# Altium schematic sheet sb-sonata-fpga.SchDoc: FPGA Config & Misc
size Letter; Organization: NewAE Technology Inc.; Address1: 1083 Queen St., Suite 196; Address2: Halifax; Address3: NS; Address4: Canada B3H 0B2; SheetNumber: 11; SheetTotal: 20; SheetApproved: YES
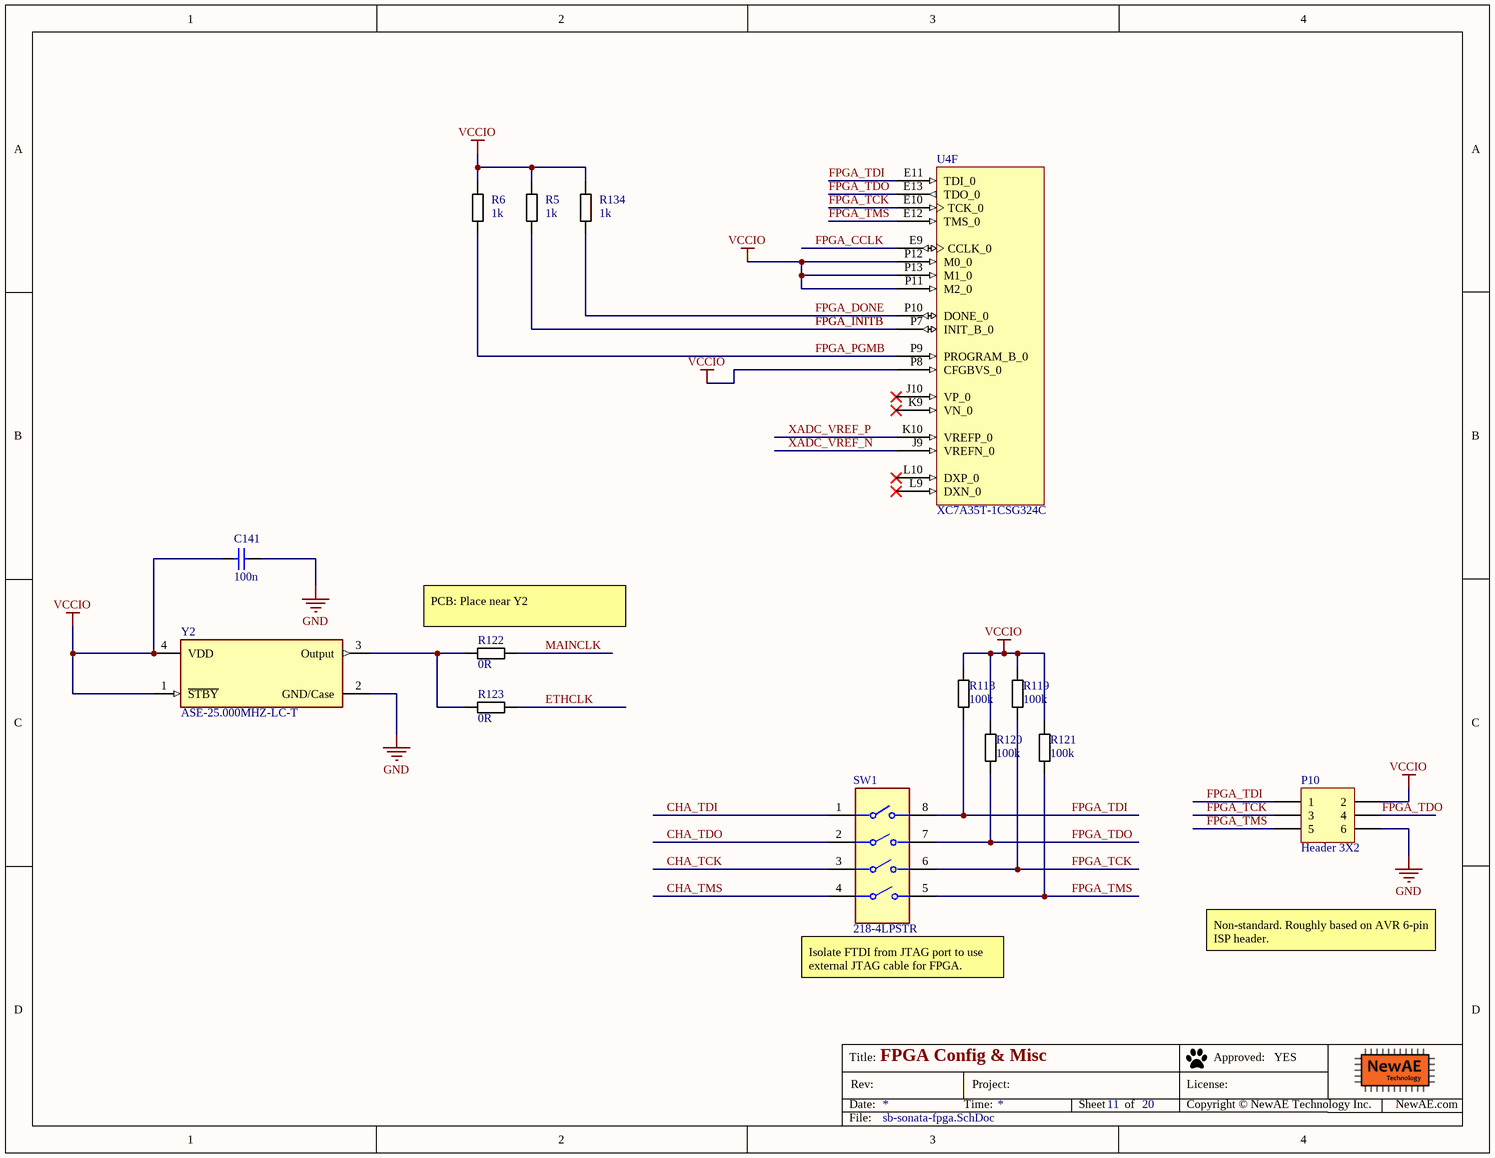
[diagram p0: sb-sonata-fpga.SchDoc]

## Parts
C141  100n  [CAPC0402_M]
P10  Header 3X2  [HDR2X3]
R5  1k  [RESC1608X55N]
R6  1k  [RESC1608X55N]
R118  100k  [RESC1005X40N]
R119  100k  [RESC1005X40N]
R120  100k  [RESC1005X40N]
R121  100k  [RESC1005X40N]
R122  0R  [RESC1608X55N]
R123  0R  [RESC1608X55N]
R134  1k  [RESC1608X55N]
SW1  218-4LPSTR  [FP-218-4LPSTR-MFG]
U4  XC7A35T-1CSG324C  [CSG324]  (part F of 9)
Y2  ASE-25.000MHZ-LC-T  [FP-ASE-MFG]

## Nets
GND: C141.2 P10.6 Y2.2(GND/Case)
VCCIO: C141.1 P10.2 R5.1 R6.1 R118.1 R119.1 R120.1 R121.1 R134.1 U4.P8(CFGBVS_0) U4.P11(M2_0) U4.P12(M0_0) U4.P13(M1_0) Y2.1(~{STBY}) Y2.4(VDD)
CHA_TCK: SW1.3
CHA_TDI: SW1.1
CHA_TDO: SW1.2
CHA_TMS: SW1.4
ETHCLK: R123.2
FPGA_CCLK: U4.E9(CCLK_0)
FPGA_DONE: R134.2 U4.P10(DONE_0)
FPGA_INITB: R5.2 U4.P7(INIT_B_0)
FPGA_PGMB: R6.2 U4.P9(PROGRAM_B_0)
FPGA_TCK: P10.3 R119.2 SW1.6 U4.E10(TCK_0)
FPGA_TDI: P10.1 R118.2 SW1.8 U4.E11(TDI_0)
FPGA_TDO: P10.4 R120.2 SW1.7 U4.E13(TDO_0)
FPGA_TMS: P10.5 R121.2 SW1.5 U4.E12(TMS_0)
MAINCLK: R122.2
XADC_VREF_N: U4.J9(VREFN_0)
XADC_VREF_P: U4.K10(VREFP_0)
NetR122_1: R122.1 R123.1 Y2.3(Output)

Not connected (* = marked no-connect by the designer): U4 J10(VP_0)* K9(VN_0)* L9(DXN_0)* L10(DXP_0)*

## Notes on the sheet
- (near R122) PCB: Place near Y2
- (near SW1) Isolate FTDI from JTAG port to use external JTAG cable for FPGA.
- Non-standard. Roughly based on AVR 6-pin ISP header.
- Title:
- Date:
- Rev:
- Time:
- Project:
- Sheet
- of
- License:
- Copyright © NewAE Technology Inc.
- Approved:
- NewAE.com
- File:

## Library data of the parts
C141 = CCHIP-100n-0402: 100n, 0402; Manufacture Part Number 1: CGA2B3X7R1V104K050BB; Component Group: Capacitor; Case-EIA: 0402; Part Number: CCHIP-100n-0402; Footprint: 0402; Pin Count: 2; Supplier 1: Digi-Key; Supplier Part Number 1: 445-6901-1-ND; Value: 100n; Mounting Technology: SMT; Component Kind: Standard; Component Type: Standard
P10 = Header 3X2: Header, 3-Pin, Dual row; LatestRevisionDate: 17-Jul-2002; LatestRevisionNote: Re-released for DXP Platform.; Publisher: Altium Limited
R5 R6 R134 = RCHIP-1K-0603: 1k res, 0603, 1%, 1/10W; Manufacture 1: Yageo; Manufacture Part Number 1: RC0603FR-071KL; Component Group: Resistor; Case-EIA: 0603; Case-Metric: 1608; Rated Power: 0.1W; Rated Voltage: 75VDC; Part Number: RCHIP-1K-0603; Footprint: 0603; Pin Count: 2; Supplier 1: Digi-Key; Supplier Part Number 1: 311-1.00KHRCT-ND; Value: 1k; Tolerance: 1%; Mounting Technology: SMT; Temperature Range: -55C to 155C; Component Kind: Standard; Component Type: Standard
R118-R121 = RCHIP-100K-0402: 100k res, 0402, 1%, 1/16W; Manufacture 1: Yageo; Manufacture Part Number 1: RC0402FR-07100KL; Component Group: Resistor; Case-EIA: 0402; Case-Metric: 1005; Rated Power: 0.063W; Rated Voltage: 75VDC; Part Number: RCHIP-100K-0402; Footprint: 0402; Pin Count: 2; Supplier 1: Digi-Key; Supplier Part Number 1: 311-100KLRCT-ND; Value: 100k; Tolerance: 1%; Mounting Technology: SMT; Temperature Range: -55C to 155C; Component Kind: Standard; Component Type: Standard
R122 R123 = RCHIP-0R-0603: 0R, 0603, 1/10W; Manufacture 1: Yageo; Manufacture Part Number 1: RC0603FR-070RL; Component Group: Resistor; Case-EIA: 0603; Case-Metric: 1608; Rated Power: 0.1W; Rated Voltage: 75VDC; Tolerance: 1%; Part Number: RCHIP-0R-0603; Footprint: 0603; Pin Count: 2; Supplier 1: Digi-Key; Supplier Part Number 1: 311-0.0HRCT-ND; Value: 0R; Mounting Technology: SMT; Temperature Range: -55C to 155C; Component Kind: Standard; Component Type: Standard
SW1 = CMP-07018-000008-1: SWITCH SLIDE DIP SPST 25MA 24V; Number of Positions: 4; Washable: Yes; Pitch: 0.05inch; Actuator Type: Slide (Standard); Electrical Life: 1000Cycles; Current Rating: 25mA; Contact Material: Copper; Max Current Rating: 25mA; Termination: Gull Wing; Throw Configuration: SPST; Mount: Surface Mount; Radiation Hardening: No; Contact Plating: Gold; Length: 0.246inch; Depth: 8.44mm; Package Quantity: 2000; Packaging: Tape and Reel; Series: 218; Lead Free: Lead Free; Voltage Rating (DC): 24V; Min Operating Temperature: -55°C; RoHS Compliant: Yes; Mechanical Life: 1000Cycles; Max Operating Temperature: 85°C; Orientation: Straight; Max Voltage Rating (DC): 24V
U4 = CMP-0383-00012-1: Artix-7 FPGA, 210 User I/Os, 0 GTP, 324-Ball BGA, Speed Grade 1, Commercial Grade, Pb-Free; Manufacturer: Xilinx; GTP: 0; Available User I/O: 210; Speed Grades: 1; Logic Cells: 33280; Total Block RAM: 1800 Kb; CMTs: 5; Maximum Distributed RAM: 400 Kb; ComponentLink2URL: http://www.xilinx.com/support/documentation/data_sheets/ds180_7Series_Overview.pdf; ComponentLink2Description: Datasheet; DatasheetVersion: Rev. 1.15; PackageDescription: 324-Ball Wire-Bond Chip-Scale BGA, Body 15 x 15 mm, Pitch 0.8 mm; ComponentLink4URL: http://www.xilinx.com/support/documentation/user_guides/ug475_7Series_Pkg_Pinout.pdf; PackageReference: CSG-324; Mounting Technology: Surface Mount; PackageVersion: Rev. 1.11; ComponentLink1Description: Manufacturer URL; ComponentLink3Description: Pinout; ComponentLink1URL: http://www.xilinx.com/; ComponentLink3URL: http://www.xilinx.com/support/documentation/user_guides/ug475_7Series_Pkg_Pinout.pdf; PartNumber: XC7A35T-1CSG324C; ComponentLink4Description: Package Specification; Operating Temperature Range: Commercial
Y2 = CMP-2000-05795-3: XTAL Oscillator 25MHz ±50ppm CMOS 3.3V 4-SMD 3.2mm x 2.5mm; Load Capacitance: 15pF; Min Supply Voltage: 3.135V; Max Supply Voltage: 3.465V; Max Supply Current: 13mA; Max Operating Temperature: 85°C; Termination: SMD/SMT; Operating Frequency: 25 MHz; Height: 0.047inch; Frequency: 25MHz; Mount: Surface Mount; Number of Pins: 4; Length: 3.2mm; Packaging: Tape and Reel; Frequency Stability: 50ppm; Series: ASE; Radiation Hardening: No; Package Quantity: 1000; Width: 2.5mm; Min Operating Temperature: -40°C; Lead Free: Lead Free; Case/Package: SMD/SMT; Depth: 2.5mm; Operating Supply Voltage: 3.3V